# EAGLE design main (EAGLE 9.4.2)

## Sheet 1 of 2
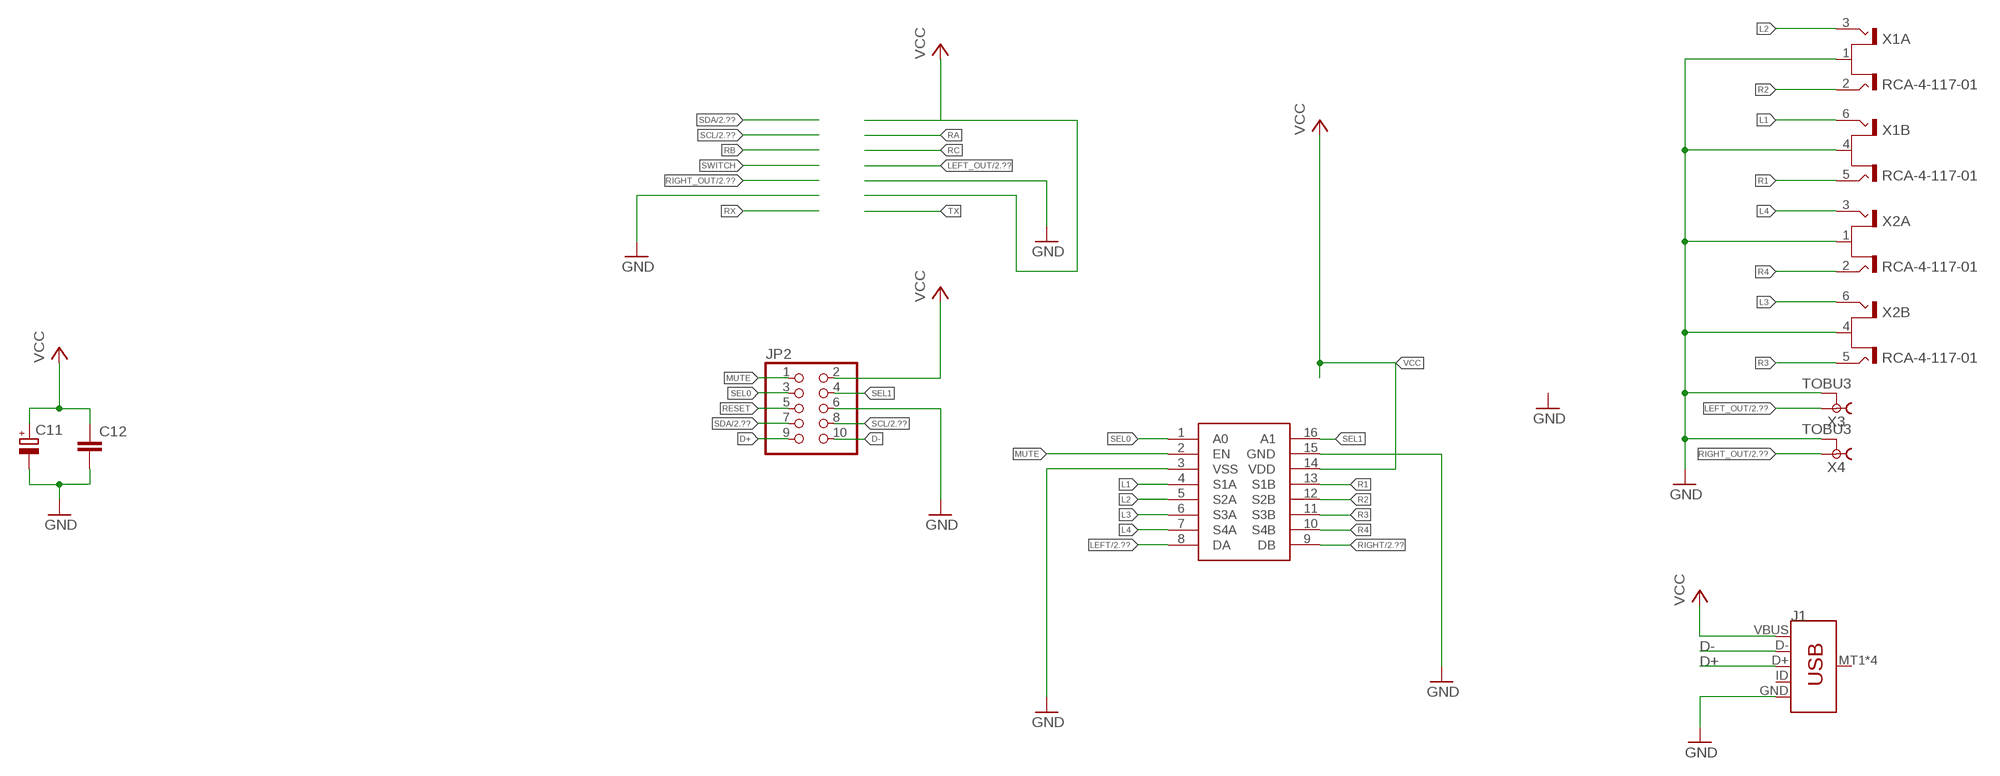
[diagram p0: schematic, sheet 1]

### Parts
C11  47uF  CPOL-EUD  [PANASONIC_D]
C12  C-EUC1206  [C1206]
J1  USB_MICRO-B_SMT  [USB-MICROB]
JP2  PINHD-2X5  [2X05]
U2  ADG709  [TSSOP-16]
X1  RCA-4-117-01  [RCA-4-117-01]
X2  RCA-4-117-01  [RCA-4-117-01]
X3  TOBU3  [TOBU3]
X4  TOBU3  [TOBU3]

### Nets
D+: J1.D+ JP2.9
D-: J1.D- JP2.10
GND [Power]: C11.- C12.2 J1.GND JP2.6 U2.3(VSS) U2.15(GND) X1.1(A:S) X1.4(B:S) X2.1(A:S) X2.4(B:S) X3.2 X3.2@1 X3.2@2 X4.2 X4.2@1 X4.2@2 ; also sheet 2
L1: U2.4(S1A) X1.6(B:T2)
L2: U2.5(S2A) X1.3(A:T2)
L3: U2.6(S3A) X2.6(B:T2)
L4: U2.7(S4A) X2.3(A:T2)
LEFT: U2.8(DA) ; also sheet 2
LEFT_OUT: X3.1 ; also sheet 2
MUTE: JP2.1 U2.2(EN)
R1: U2.13(S1B) X1.5(B:T1)
R2: U2.12(S2B) X1.2(A:T1)
R3: U2.11(S3B) X2.5(B:T1)
R4: U2.10(S4B) X2.2(A:T1)
RESET: JP2.5
RIGHT: U2.9(DB) ; also sheet 2
RIGHT_OUT: X4.1 ; also sheet 2
SCL: JP2.8 ; also sheet 2
SDA: JP2.7 ; also sheet 2
SEL0: JP2.3 U2.1(A0)
SEL1: JP2.4 U2.16(A1)
VCC [Power]: C11.+ C12.1 J1.VBUS JP2.2 U2.14(VDD) ; also sheet 2
Unconnected: J1.ID J1.MT1(SHIELD) J1.MT2(SHIELD) J1.P$1(SHIELD) J1.P$2(SHIELD)

## Sheet 2 of 2
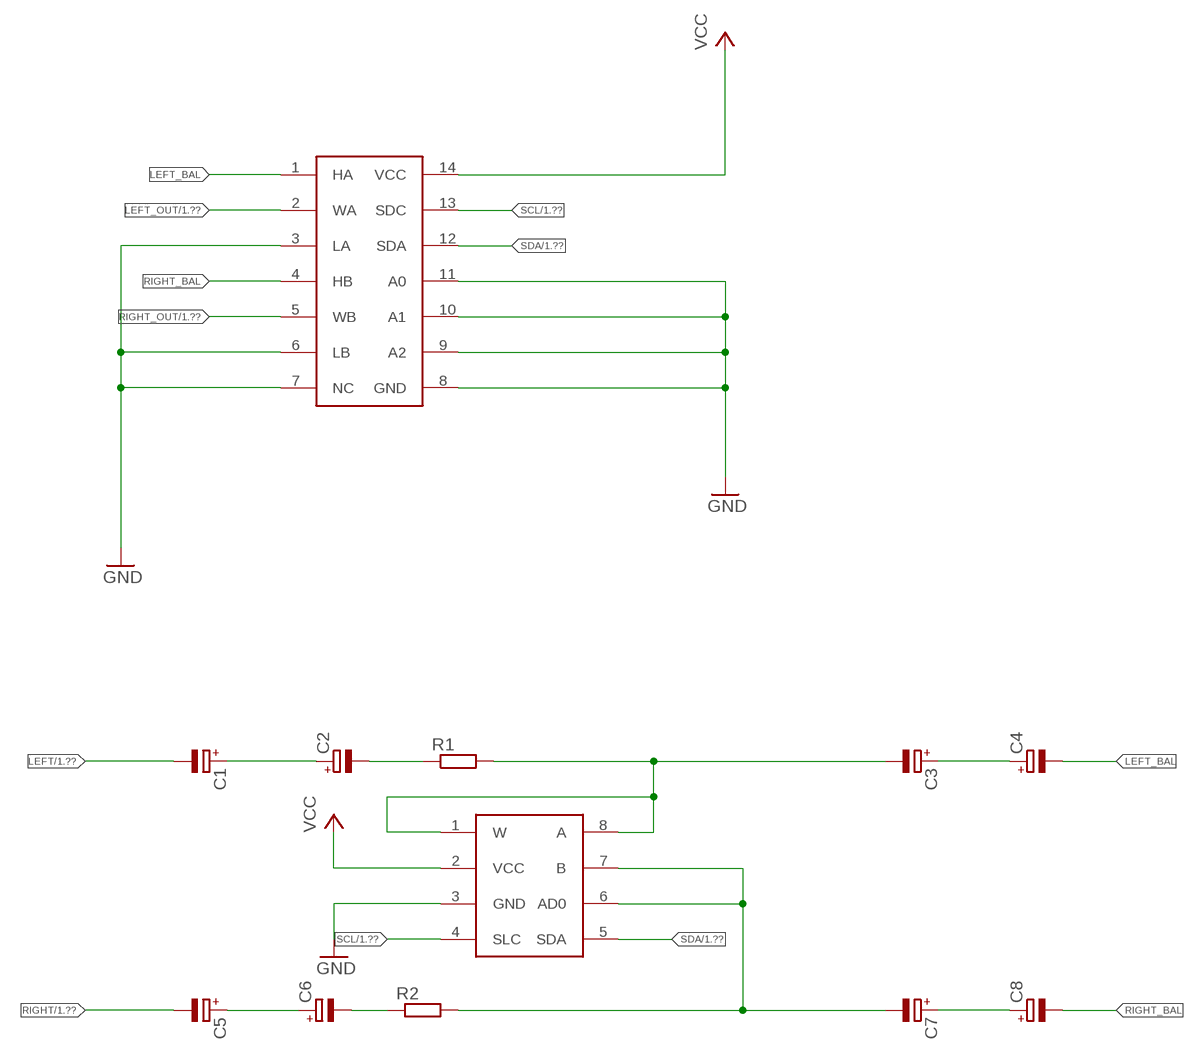
[diagram p1: schematic, sheet 2]

### Parts
C1  47uF  CPOL-EUD  [PANASONIC_D]
C2  47uF  CPOL-EUD  [PANASONIC_D]
C3  47uF  CPOL-EUD  [PANASONIC_D]
C4  47uF  CPOL-EUD  [PANASONIC_D]
C5  47uF  CPOL-EUD  [PANASONIC_D]
C6  47uF  CPOL-EUD  [PANASONIC_D]
C7  47uF  CPOL-EUD  [PANASONIC_D]
C8  47uF  CPOL-EUD  [PANASONIC_D]
R1  R-EU_M1206  [M1206]
R2  R-EU_M1206  [M1206]
U3  AD5273  [SOT23-8]
U4  MAX5387  [TSSOP-14]

### Nets
GND [Power]: U3.3(GND) U4.3(LA) U4.6(LB) U4.7(NC) U4.8(GND) U4.9(A2) U4.10(A1) U4.11(A0) ; also sheet 1
LEFT: C1.- ; also sheet 1
LEFT_BAL: C4.- U4.1(HA)
LEFT_OUT: U4.2(WA) ; also sheet 1
N$10: C1.+ C2.+
N$11: C5.+ C6.+
N$12: C7.- R2.2 U3.6(AD0) U3.7(B)
N$13: C7.+ C8.+
N$14: C3.+ C4.+
N$15: C2.- R1.1
N$18: C3.- R1.2 U3.1(W) U3.8(A)
N$19: C6.- R2.1
RIGHT: C5.- ; also sheet 1
RIGHT_BAL: C8.- U4.4(HB)
RIGHT_OUT: U4.5(WB) ; also sheet 1
SCL: U3.4(SLC) U4.13(SDC) ; also sheet 1
SDA: U3.5(SDA) U4.12(SDA) ; also sheet 1
VCC [Power]: U3.2(VCC) U4.14(VCC) ; also sheet 1

## Library data of the parts
C1-C8 C11 = resistor:CPOL-EU: POLARIZED CAPACITOR, European symbol
C12 = resistor:C-EU: CAPACITOR, European symbol
J1 = SparkFun-Connectors:USB_MICRO-B: USB Type Micro-B Connector Male/female and PTH/SMT variants SparkFun Products: SparkFun microB USB Breakout <https://www.sparkfun.com/products/12035> SparkFun USB microB Plug Breakout <https://www.sparkfun.com/products/10031> SparkFun ESP8266 Thing <https://www.sparkfun.com/products/13231>; PROD_ID: CONN-09505; SF_ID: PRT-08533
JP2 = pinhead:PINHD-2X5: PIN HEADER
R1 R2 = resistor:R-EU_: RESISTOR, European symbol
U2 = ube:ADG709
U3 = ube:AD5273
U4 = ube:MAX5387
X1 X2 = con-conrad:RCA-4-117-01: Cinch-Anschlussplatte 72385 Gold, Rot, Weiß BKL Electronic Conrad Bestellnummer : 736910 - 62 Source: Data sheet <http://www.produktinfo.conrad.com/datenblaetter/725000-749999/736910-da-01-en-Cinch_Anschlussplatte_4polig.pdf>
X3 X4 = con-hirschmann:TOBU3: Female Cinch CONNECTOR ( RCA Jack ); MF: FARNELL; MPN: TOBU 3; OC_FARNELL: 592791; OC_NEWARK: 06WX5914

## Net classes
0 default: width 0.254 mm
1 Power: width 0.356 mm

## Board
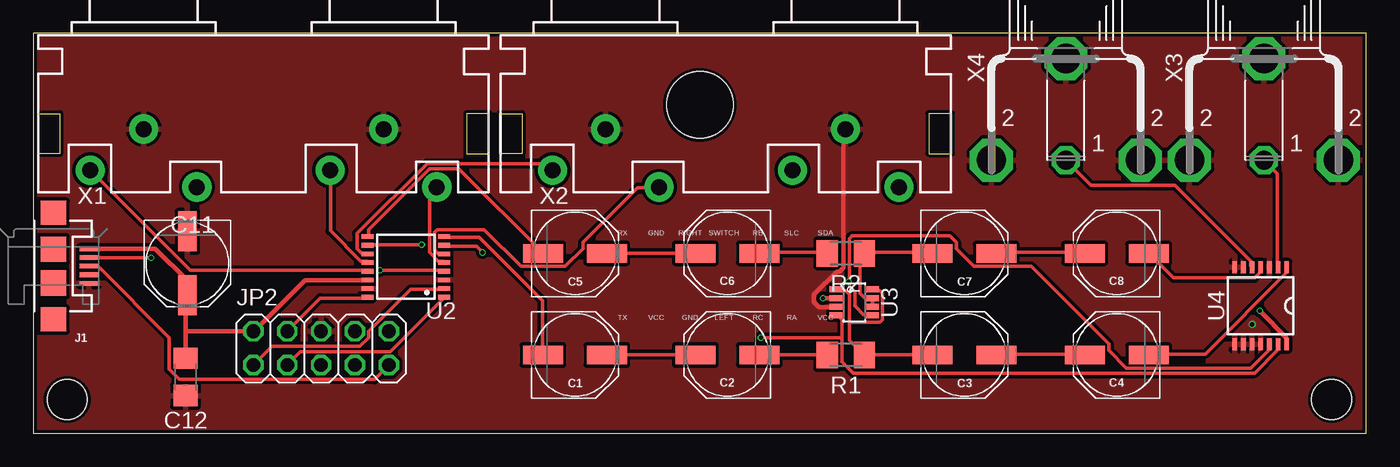
[diagram p2: board, top side]
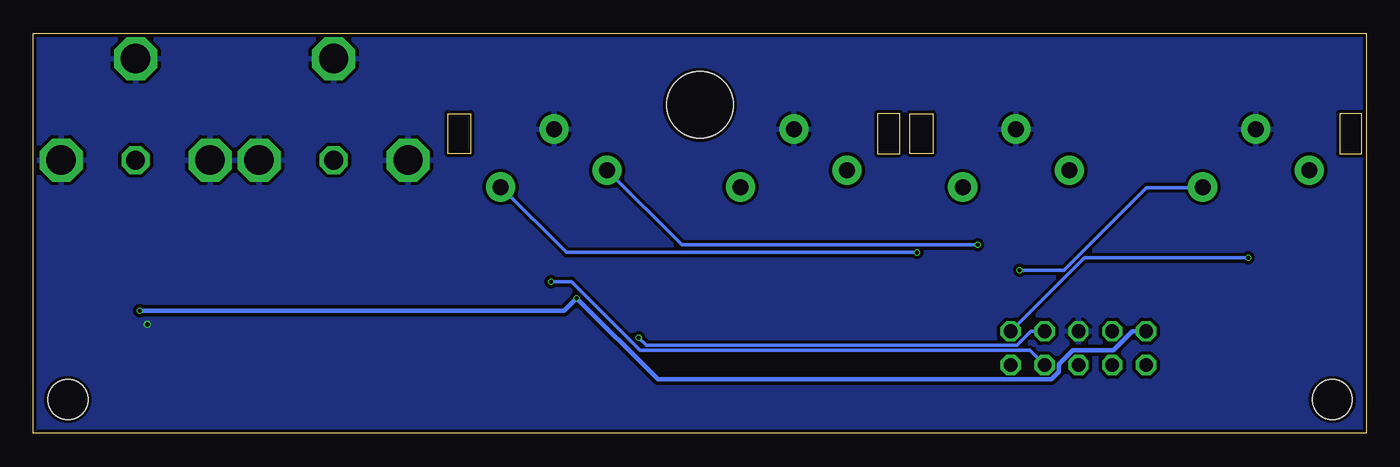
[diagram p3: board, bottom side, seen from below]

Size 100 x 30 mm. Coordinates in mm from the lower left corner, seen from the top.
Outline: 0,0 100,0 100,30 0,30 0,0
Copper layers (1*16): Top 0.035559375mm / dielectric 1.6mm / Bottom 0.035559375mm
Design rules "jlcpcb2layer": minimum track width 5mil, minimum drill 12mil, track to track 5mil, track to pad 5mil, pad to pad 5mil, via to via 5mil, smd to smd 5mil, copper to edge 8mil, drill to drill 6mil, minimum pad ring 5mil, minimum via ring 3mil, stop-mask expansion 2.5mil, vias tented up to drill 0mil, thermal gap 10mil
Holes 3 mm at 2.54,2.53 97.41,2.53
Holes 5 mm at 50,24.63

### Footprints (pad centres in the part's own frame; a part is rotated, then mirrored left to right if it is on the bottom)
PANASONIC_D = smd 3 x 1.4: + 2.4,0; - -2.4,0
C1206 = smd 1.6 x 1.8: 1 -1.4,0; 2 1.4,0
USB-MICROB = smd 1.4 x 0.35: D+ -2.65,0; D- -2.65,-0.65; GND -2.65,1.3; ID -2.65,0.65; VBUS -2.65,-1.3 | smd 1.9 x 1.8: MT1 0,-4; MT2 0,4 | smd 1.9 x 1.9: P$1 0,-1.27; P$2 0,1.27
2X05 = drill 1.016 octagon: 1 -5.08,-1.27; 2 -5.08,1.27; 3 -2.54,-1.27; 4 -2.54,1.27; 5 0,-1.27; 6 0,1.27; 7 2.54,-1.27; 8 2.54,1.27; 9 5.08,-1.27; 10 5.08,1.27
M1206 = smd 1.6 x 2: 1 -1.4,0; 2 1.4,0
TSSOP-16 = smd 0.9 x 0.35: 1 -2.875,2.275; 2 -2.875,1.625; 3 -2.875,0.975; 4 -2.875,0.325; 5 -2.875,-0.325; 6 -2.875,-0.975; 7 -2.875,-1.625; 8 -2.875,-2.275; 9 2.875,-2.275; 10 2.875,-1.625; 11 2.875,-0.975; 12 2.875,-0.325; 13 2.875,0.325; 14 2.875,0.975; 15 2.875,1.625; 16 2.875,2.275
SOT23-8 = smd 0.45 x 1.1: 1 -0.975,-1.3; 2 -0.325,-1.3; 3 0.325,-1.3; 4 0.975,-1.3; 5 0.975,1.3; 6 0.325,1.3; 7 -0.325,1.3; 8 -0.975,1.3
TSSOP-14 = smd 0.9 x 0.35: 1 -2.875,1.95; 2 -2.875,1.3; 3 -2.875,0.65; 4 -2.875,0; 5 -2.875,-0.65; 6 -2.875,-1.3; 7 -2.875,-1.95; 8 2.875,-1.95; 9 2.875,-1.3; 10 2.875,-0.65; 11 2.875,0; 12 2.875,0.65; 13 2.875,1.3; 14 2.875,1.95
RCA-4-117-01 = drill 1.2 pad 2.184: 1 9,3.1; 2 5,0; 3 13,-1.25; 4 -9,3.1; 5 -13,0; 6 -5,-1.25
TOBU3 = drill 1.397 octagon: 1 0,-2.54 | drill 2.21 octagon: 2 5.588,-2.54; 2@1 -5.588,-2.54; 2@2 0,5.08

### Placement (x,y rotation side)
C1  40.64,5.88 0 top
C2  52.07,5.88 180 top
C3  69.85,5.88 0 top
C4  81.28,5.88 180 top
C5  40.64,13.5 0 top
C6  52.07,13.5 180 top
C7  69.85,13.5 0 top
C8  81.28,13.5 180 top
C11  11.56,12.74 270 top
C12  11.43,4.23 270 top
J1  1.52,12.54 180 top
JP2  21.59,6.39 0 top
R1  60.96,5.88 0 top
R2  60.96,13.5 0 top
U2  27.94,12.48 180 top
U3  61.59,9.82 270 top
U4  92.08,9.56 270 top
X1  17.27,19.72 0 top
X2  51.94,19.72 0 top
X3  92.33,23.02 0 top
X4  77.47,23.02 0 top

### Tracks (layer width: path | path; a pad name or v marks a point on that pad's centre or on a via)
D+
  Top 0.254: J1.D+ 4.2,12.52 4.86,12.52 10.19,7.18 10.19,4.8 10.95,4.04 25.59,4.04 JP2.9
D-  (via drill 0.3)
  Top 0.254: v8.86,13.18 J1.D-
  Bottom 0.254: v8.86,13.18 21.14,13.18 JP2.10
GND  (via drill 0.35)
  Top 0.356: U3.3 60.29,9.47 58.96,9.47 58.58,9.85 58.58,10.42 60.29,12.13 60.48,12.13 60.77,12.42 60.77,22.71 60.87,22.8 X2.1
  other vias: 91.44,8.17
  pour Bottom (isolate 0.254): -2.54,31.28 100.33,31.28 100.33,-1.74 -2.54,-1.74
  pour Top (isolate 0.254): -2.54,32.55 100.33,32.55 100.33,-0.47 -2.54,-0.47
L1  (via drill 0.3)
  Top 0.254: v26,12.23 30.77,12.23 U2.4
  Bottom 0.254: v26,12.23 22.67,12.23 16.48,18.42 12.29,18.42 X1.6
L2
  Top 0.254: U2.5 30.77,12.9 30.39,12.9 29.72,13.56 29.72,17.95 30.19,18.42 X1.3
L3
  Top 0.254: X2.6 46.89,18.42 45.34,18.42 41.24,14.33 41.24,13.85 39.91,12.52 36.58,12.52 33.81,15.28 30.29,15.28 30.1,15.09 30.1,13.75 30.39,13.47 30.81,13.47 U2.6
L4  (via drill 0.3)
  Top 0.254: v33.72,13.56 33.24,14.04 30.86,14.04 U2.7
  Bottom 0.254: v33.72,13.56 60.01,13.56 64.86,18.42 X2.3
LEFT
  Top 0.254: C1.- 38.2,5.92 38.2,9.94 33.43,14.71 30.87,14.71 U2.8
LEFT_BAL
  Top 0.254: U4.1 94.01,12.42 94.01,12.04 87.92,5.94 83.72,5.94 C4.-
LEFT_OUT
  Top 0.254: U4.2 93.34,12.52 93.34,19.47 92.39,20.42 X3.1
MUTE
  Top 0.254: U2.2 30.77,10.8 28.29,10.8 25.15,7.66 25.15,7.18 24.48,6.52 17.91,6.52 16.57,5.18 JP2.1
N$10
  Top 0.254: C2.+ C1.+
N$11
  Top 0.254: C6.+ C5.+
N$12
  Top 0.254: U3.6 62.96,9.56 62.96,10.13 U3.7 62.38,10.14 62.01,10.52 62.01,13.15 R2.2 62.39,13.56 67.44,13.56 C7.-
N$13
  Top 0.254: C7.+ 72.3,13.56 78.87,13.56 C8.+
N$14
  Top 0.254: C3.+ 72.3,5.94 78.87,5.94 C4.+
N$15
  Top 0.254: C2.- R1.1
N$18
  Top 0.254: 61.25,8.33 61.25,6.99 62.29,5.94 R1.2 C3.- | 61.25,8.33 61.25,10.42 60.96,10.71 60.39,10.71 U3.1 | U3.8 62.96,10.71 63.53,10.71 63.72,10.52 63.72,8.52 63.53,8.33 61.34,8.33 61.25,8.33
N$19
  Top 0.254: R2.1 59.53,13.56 54.48,13.56 C6.-
R1
  Top 0.254: U2.13 24.99,12.23 11.77,12.23 X1.5
R2
  Top 0.254: U2.12 25.05,12.9 24.57,12.9 22.29,15.18 22.29,19.66 X1.2
R3
  Top 0.254: U2.11 25.05,13.47 24.67,13.47 24.29,13.85 24.29,14.99 29.53,20.23 38.39,20.23 38.86,19.75 X2.5
R4  (via drill 0.3)
  Top 0.254: v29.15,14.13 25.15,14.13 U2.10
  Bottom 0.254: v29.15,14.13 51.34,14.13 56.86,19.66 X2.2
RIGHT
  Top 0.254: U2.9 25.15,14.8 25.15,15.28 29.72,19.85 31.91,19.85 38.2,13.56 C5.-
RIGHT_BAL
  Top 0.254: U4.4 92.01,12.42 92.01,12.04 91.63,11.66 85.53,11.66 83.72,13.47 C8.-
RIGHT_OUT
  Top 0.254: U4.5 91.34,12.52 91.34,12.9 85.63,18.61 79.34,18.61 77.53,20.42 X4.1
SCL  (via drill 0.3)
  Top 0.254: 60.67,7.18 60.67,8.52 60.39,8.8 U3.4 | 60.67,7.18 60.67,5.37 61.53,4.52 91.63,4.52 93.34,6.23 93.34,6.66 U4.13 | v54.58,7.18 60.58,7.18 60.67,7.18
  Bottom 0.254: v54.58,7.18 54.01,6.61 26.19,6.61 25.15,7.66 24.19,7.66 JP2.8
SDA  (via drill 0.3)
  Top 0.254: 61.25,11.37 61.25,10.99 61.63,10.61 61.63,9.56 62.29,8.9 62.84,8.9 U3.5 | 61.25,11.37 61.25,14.61 61.44,14.8 68.77,14.8 69.25,14.33 69.25,13.85 70.58,12.52 74.87,12.52 80.68,6.71 80.68,6.23 82.01,4.9 91.34,4.9 92.68,6.23 92.68,6.61 U4.12 | v61.15,11.37 61.25,11.37
  Bottom 0.254: v61.15,11.37 59.63,11.37 54.48,6.23 25.24,6.23 JP2.7
SEL0
  Top 0.254: U2.1 30.77,10.13 26.77,6.13 20,6.13 19.05,5.18 JP2.3
SEL1
  Top 0.254: JP2.4 21.53,10.13 25.05,10.13 U2.16
VCC  (via drill 0.3)
  Top 0.356: U2.14 25.05,11.47 20.38,11.47 16.57,7.66 JP2.2 16.38,7.66 11.53,7.66 11.43,7.66 | 11.43,7.66 11.43,10.23 C11.+ 11.53,10.37 11.53,11.47 9.15,13.84 J1.VBUS | 11.43,7.66 11.43,5.66 C12.1 | v92.01,9.18 94.01,7.18 94.01,6.71 U4.14 | v59.24,10.13 U3.2
  Bottom 0.356: v92.01,9.18 60.2,9.18 v59.24,10.13 53.15,4.04 23.62,4.04 23.05,4.61 23.05,5.18 22,6.23 18.95,6.23 17.53,7.66 JP2.2

### Text on the board
tPlace: RX | GND | RIGHT | SWITCH | RB | SLC | SDA | TX | VCC | GND | LEFT | RC | RA | VCC